# EAGLE design CurrentMetterLEDScreen (EAGLE 6.1)
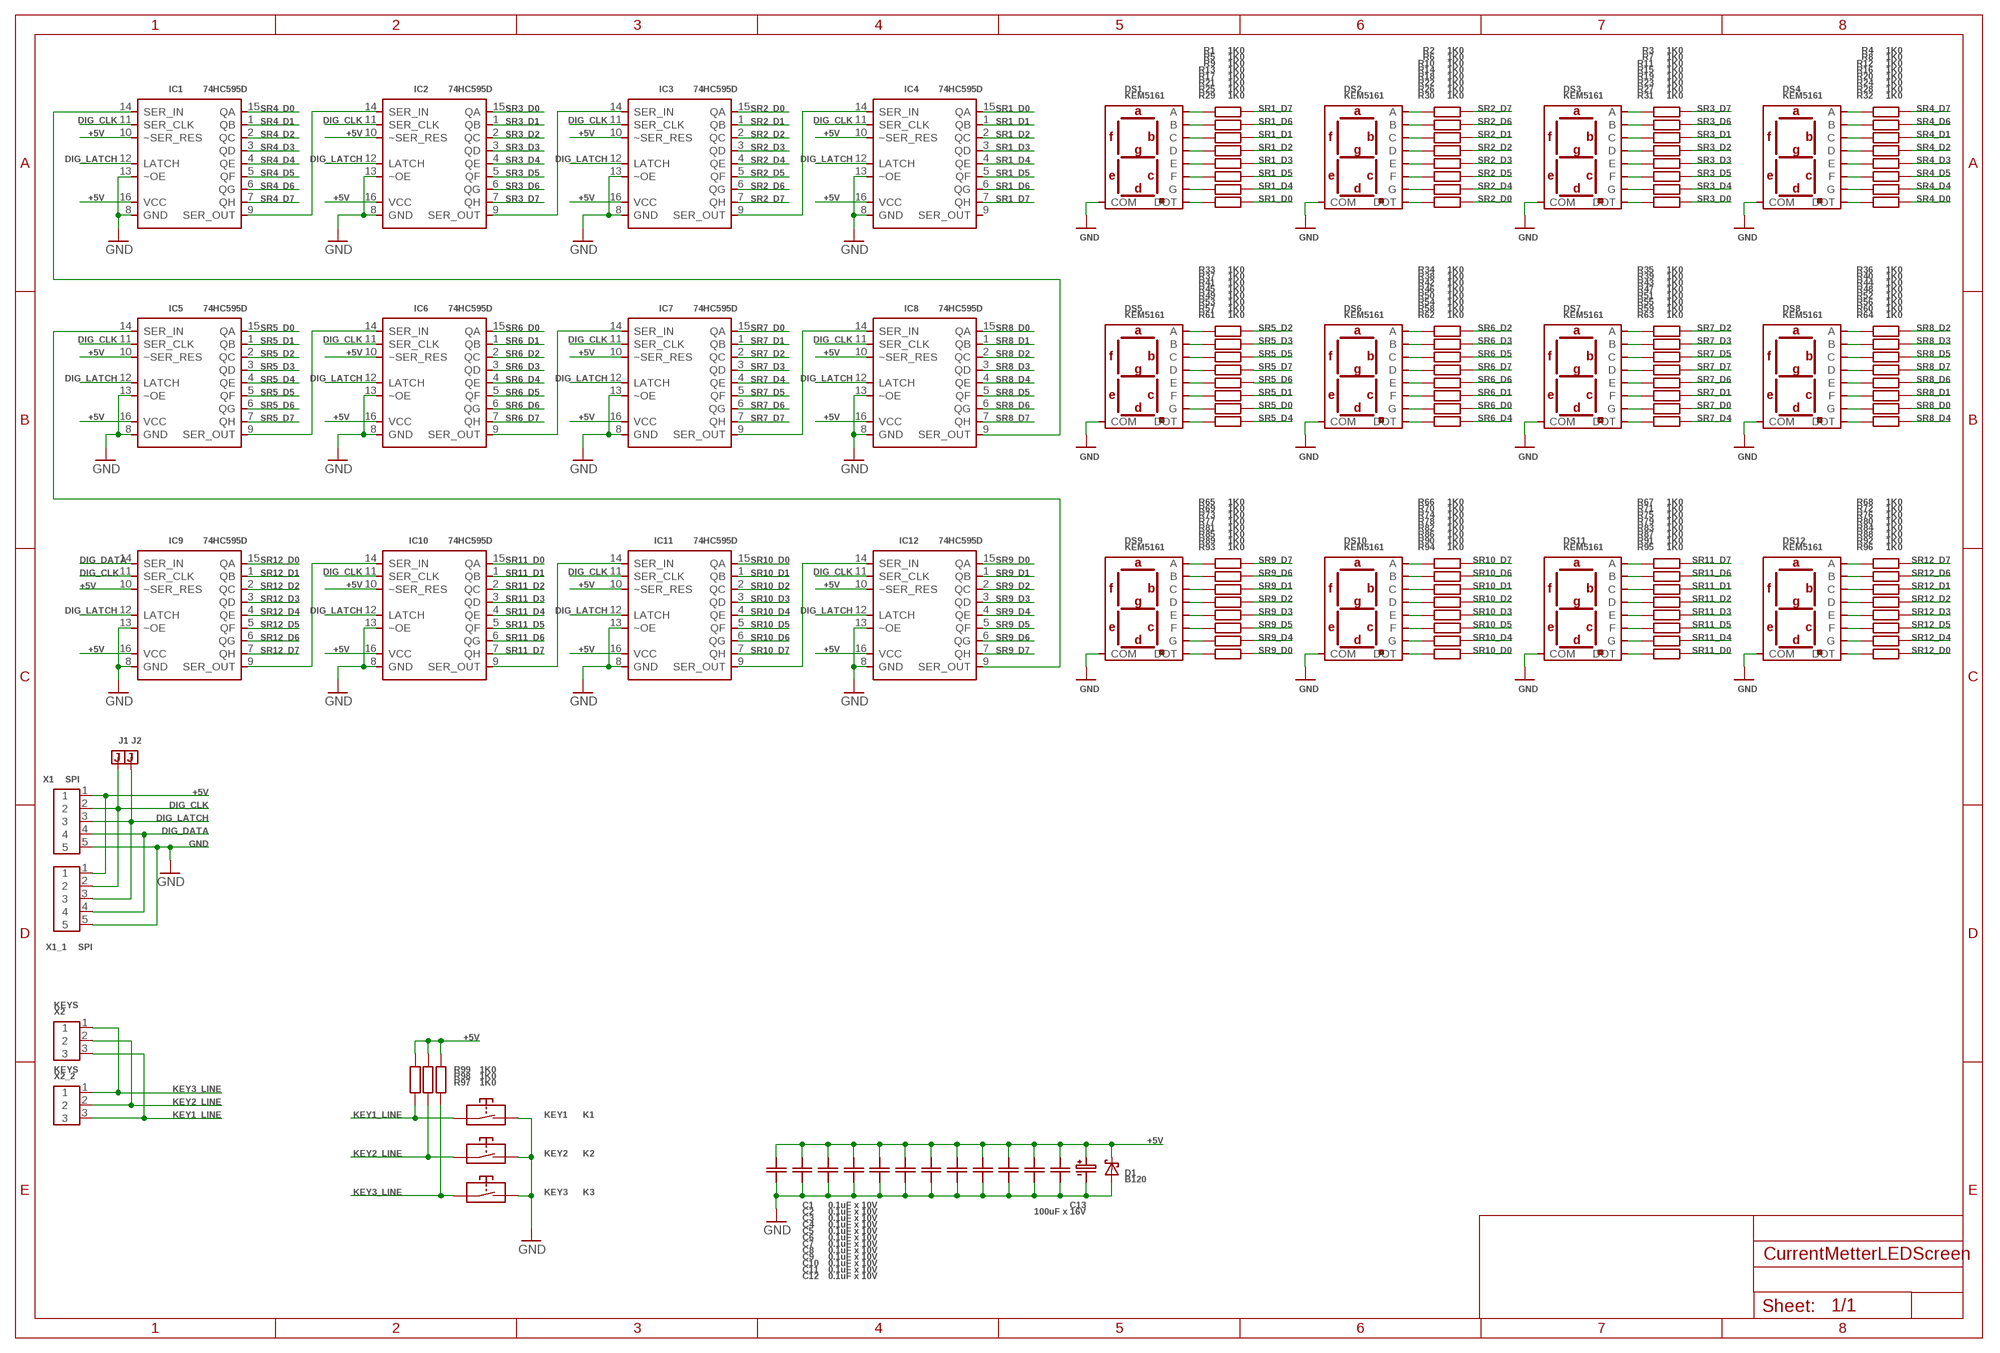
[diagram p0: schematic, sheet 1]

## Parts
C1  0.1uF x 10V  CSMD_0603  [RSMD_0603]
C2  0.1uF x 10V  CSMD_0603  [RSMD_0603]
C3  0.1uF x 10V  CSMD_0603  [RSMD_0603]
C4  0.1uF x 10V  CSMD_0603  [RSMD_0603]
C5  0.1uF x 10V  CSMD_0603  [RSMD_0603]
C6  0.1uF x 10V  CSMD_0603  [RSMD_0603]
C7  0.1uF x 10V  CSMD_0603  [RSMD_0603]
C8  0.1uF x 10V  CSMD_0603  [RSMD_0603]
C9  0.1uF x 10V  CSMD_0603  [RSMD_0603]
C10  0.1uF x 10V  CSMD_0603  [RSMD_0603]
C11  0.1uF x 10V  CSMD_0603  [RSMD_0603]
C12  0.1uF x 10V  CSMD_0603  [RSMD_0603]
C13  100uF x 16V  CE6.3MM_HOR_REVERTED  [CE_6.3MM_HOR_REVERTED]
D1  B120  B120(DO-214AC)  [DO-214AC]
DS1  KEM5161  KEM5161(NARROW_PADS_OUTSIDE)  [KEM-5161(NARROW_PADS_OUTSIDE)]
DS2  KEM5161  KEM5161(NARROW_PADS_OUTSIDE)  [KEM-5161(NARROW_PADS_OUTSIDE)]
DS3  KEM5161  KEM5161(NARROW_PADS_OUTSIDE)  [KEM-5161(NARROW_PADS_OUTSIDE)]
DS4  KEM5161  KEM5161(NARROW_PADS_OUTSIDE)  [KEM-5161(NARROW_PADS_OUTSIDE)]
DS5  KEM5161  KEM5161(NARROW_PADS_OUTSIDE)  [KEM-5161(NARROW_PADS_OUTSIDE)]
DS6  KEM5161  KEM5161(NARROW_PADS_OUTSIDE)  [KEM-5161(NARROW_PADS_OUTSIDE)]
DS7  KEM5161  KEM5161(NARROW_PADS_OUTSIDE)  [KEM-5161(NARROW_PADS_OUTSIDE)]
DS8  KEM5161  KEM5161(NARROW_PADS_OUTSIDE)  [KEM-5161(NARROW_PADS_OUTSIDE)]
DS9  KEM5161  KEM5161(NARROW_PADS_OUTSIDE)  [KEM-5161(NARROW_PADS_OUTSIDE)]
DS10  KEM5161  KEM5161(NARROW_PADS_OUTSIDE)  [KEM-5161(NARROW_PADS_OUTSIDE)]
DS11  KEM5161  KEM5161(NARROW_PADS_OUTSIDE)  [KEM-5161(NARROW_PADS_OUTSIDE)]
DS12  KEM5161  KEM5161(NARROW_PADS_OUTSIDE)  [KEM-5161(NARROW_PADS_OUTSIDE)]
IC1  74HC595D  74HC595(SOIC16)  [SOIC16]
IC2  74HC595D  74HC595(SOIC16)  [SOIC16]
IC3  74HC595D  74HC595(SOIC16)  [SOIC16]
IC4  74HC595D  74HC595(SOIC16)  [SOIC16]
IC5  74HC595D  74HC595(SOIC16)  [SOIC16]
IC6  74HC595D  74HC595(SOIC16)  [SOIC16]
IC7  74HC595D  74HC595(SOIC16)  [SOIC16]
IC8  74HC595D  74HC595(SOIC16)  [SOIC16]
IC9  74HC595D  74HC595(SOIC16)  [SOIC16]
IC10  74HC595D  74HC595(SOIC16)  [SOIC16]
IC11  74HC595D  74HC595(SOIC16)  [SOIC16]
IC12  74HC595D  74HC595(SOIC16)  [SOIC16]
J1  JUMPER0805  [RSMD_0805]
J2  JUMPER0805  [RSMD_0805]
KEY1  K1  KEY(7X4.5_BIG_PADS)  [KEY_7X4.5_BIG_PADS]
KEY2  K2  KEY(7X4.5_BIG_PADS)  [KEY_7X4.5_BIG_PADS]
KEY3  K3  KEY(7X4.5_BIG_PADS)  [KEY_7X4.5_BIG_PADS]
R1  1K0  RSMD_0603  [RSMD_0603]
R2  1K0  RSMD_0603  [RSMD_0603]
R3  1K0  RSMD_0603  [RSMD_0603]
R4  1K0  RSMD_0603  [RSMD_0603]
R5  1K0  RSMD_0603  [RSMD_0603]
R6  1K0  RSMD_0603  [RSMD_0603]
R7  1K0  RSMD_0603  [RSMD_0603]
R8  1K0  RSMD_0603  [RSMD_0603]
R9  1K0  RSMD_0603  [RSMD_0603]
R10  1K0  RSMD_0603  [RSMD_0603]
R11  1K0  RSMD_0603  [RSMD_0603]
R12  1K0  RSMD_0603  [RSMD_0603]
R13  1K0  RSMD_0603  [RSMD_0603]
R14  1K0  RSMD_0603  [RSMD_0603]
R15  1K0  RSMD_0603  [RSMD_0603]
R16  1K0  RSMD_0603  [RSMD_0603]
R17  1K0  RSMD_0603  [RSMD_0603]
R18  1K0  RSMD_0603  [RSMD_0603]
R19  1K0  RSMD_0603  [RSMD_0603]
R20  1K0  RSMD_0603  [RSMD_0603]
R21  1K0  RSMD_0603  [RSMD_0603]
R22  1K0  RSMD_0603  [RSMD_0603]
R23  1K0  RSMD_0603  [RSMD_0603]
R24  1K0  RSMD_0603  [RSMD_0603]
R25  1K0  RSMD_0603  [RSMD_0603]
R26  1K0  RSMD_0603  [RSMD_0603]
R27  1K0  RSMD_0603  [RSMD_0603]
R28  1K0  RSMD_0603  [RSMD_0603]
R29  1K0  RSMD_0603  [RSMD_0603]
R30  1K0  RSMD_0603  [RSMD_0603]
R31  1K0  RSMD_0603  [RSMD_0603]
R32  1K0  RSMD_0603  [RSMD_0603]
R33  1K0  RSMD_0603  [RSMD_0603]
R34  1K0  RSMD_0603  [RSMD_0603]
R35  1K0  RSMD_0603  [RSMD_0603]
R36  1K0  RSMD_0603  [RSMD_0603]
R37  1K0  RSMD_0603  [RSMD_0603]
R38  1K0  RSMD_0603  [RSMD_0603]
R39  1K0  RSMD_0603  [RSMD_0603]
R40  1K0  RSMD_0603  [RSMD_0603]
R41  1K0  RSMD_0603  [RSMD_0603]
R42  1K0  RSMD_0603  [RSMD_0603]
R43  1K0  RSMD_0603  [RSMD_0603]
R44  1K0  RSMD_0603  [RSMD_0603]
R45  1K0  RSMD_0603  [RSMD_0603]
R46  1K0  RSMD_0603  [RSMD_0603]
R47  1K0  RSMD_0603  [RSMD_0603]
R48  1K0  RSMD_0603  [RSMD_0603]
R49  1K0  RSMD_0603  [RSMD_0603]
R50  1K0  RSMD_0603  [RSMD_0603]
R51  1K0  RSMD_0603  [RSMD_0603]
R52  1K0  RSMD_0603  [RSMD_0603]
R53  1K0  RSMD_0603  [RSMD_0603]
R54  1K0  RSMD_0603  [RSMD_0603]
R55  1K0  RSMD_0603  [RSMD_0603]
R56  1K0  RSMD_0603  [RSMD_0603]
R57  1K0  RSMD_0603  [RSMD_0603]
R58  1K0  RSMD_0603  [RSMD_0603]
R59  1K0  RSMD_0603  [RSMD_0603]
R60  1K0  RSMD_0603  [RSMD_0603]
R61  1K0  RSMD_0603  [RSMD_0603]
R62  1K0  RSMD_0603  [RSMD_0603]
R63  1K0  RSMD_0603  [RSMD_0603]
R64  1K0  RSMD_0603  [RSMD_0603]
R65  1K0  RSMD_0603  [RSMD_0603]
R66  1K0  RSMD_0603  [RSMD_0603]
R67  1K0  RSMD_0603  [RSMD_0603]
R68  1K0  RSMD_0603  [RSMD_0603]
R69  1K0  RSMD_0603  [RSMD_0603]
R70  1K0  RSMD_0603  [RSMD_0603]
R71  1K0  RSMD_0603  [RSMD_0603]
R72  1K0  RSMD_0603  [RSMD_0603]
R73  1K0  RSMD_0603  [RSMD_0603]
R74  1K0  RSMD_0603  [RSMD_0603]
R75  1K0  RSMD_0603  [RSMD_0603]
R76  1K0  RSMD_0603  [RSMD_0603]
R77  1K0  RSMD_0603  [RSMD_0603]
R78  1K0  RSMD_0603  [RSMD_0603]
R79  1K0  RSMD_0603  [RSMD_0603]
R80  1K0  RSMD_0603  [RSMD_0603]
R81  1K0  RSMD_0603  [RSMD_0603]
R82  1K0  RSMD_0603  [RSMD_0603]
R83  1K0  RSMD_0603  [RSMD_0603]
R84  1K0  RSMD_0603  [RSMD_0603]
R85  1K0  RSMD_0603  [RSMD_0603]
R86  1K0  RSMD_0603  [RSMD_0603]
R87  1K0  RSMD_0603  [RSMD_0603]
R88  1K0  RSMD_0603  [RSMD_0603]
R89  1K0  RSMD_0603  [RSMD_0603]
R90  1K0  RSMD_0603  [RSMD_0603]
R91  1K0  RSMD_0603  [RSMD_0603]
R92  1K0  RSMD_0603  [RSMD_0603]
R93  1K0  RSMD_0603  [RSMD_0603]
R94  1K0  RSMD_0603  [RSMD_0603]
R95  1K0  RSMD_0603  [RSMD_0603]
R96  1K0  RSMD_0603  [RSMD_0603]
R97  1K0  RSMD_0603  [RSMD_0603]
R98  1K0  RSMD_0603  [RSMD_0603]
R99  1K0  RSMD_0603  [RSMD_0603]
X1  SPI  PIN1X5(2.54_SIDE_BOARD)  [PIN5X1_2.54MM_SIDE_BOARD]
X1_1  SPI  PIN1X5(2.54_VERT_CLAMP)  [PIN5X1_2.54MM_WITH_CLAMP]
X2  KEYS  PIN1X3(2.54MM_SIDE_BOARD)  [PIN1X3_2.54MM_SIDE_BOARD]
X2_2  KEYS  PIN1X3(2.54MM_WITH_CLAMP)  [PIN3X1_2.54MM_WITH_CLAMP]

## Nets
+5V: C1.PAD_1(PIN1) C2.PAD_1(PIN1) C3.PAD_1(PIN1) C4.PAD_1(PIN1) C5.PAD_1(PIN1) C6.PAD_1(PIN1) C7.PAD_1(PIN1) C8.PAD_1(PIN1) C9.PAD_1(PIN1) C10.PAD_1(PIN1) C11.PAD_1(PIN1) C12.PAD_1(PIN1) C13.PLUS D1.CATHODE IC1.10(~SER_RES) IC1.16(VCC) IC2.10(~SER_RES) IC2.16(VCC) IC3.10(~SER_RES) IC3.16(VCC) IC4.10(~SER_RES) IC4.16(VCC) IC5.10(~SER_RES) IC5.16(VCC) IC6.10(~SER_RES) IC6.16(VCC) IC7.10(~SER_RES) IC7.16(VCC) IC8.10(~SER_RES) IC8.16(VCC) IC9.10(~SER_RES) IC9.16(VCC) IC10.10(~SER_RES) IC10.16(VCC) IC11.10(~SER_RES) IC11.16(VCC) IC12.10(~SER_RES) IC12.16(VCC) R97.PAD_1(PIN1) R98.PAD_1(PIN1) R99.PAD_1(PIN1) X1.1 X1_1.1
DIG_CLK: IC1.11(SER_CLK) IC2.11(SER_CLK) IC3.11(SER_CLK) IC4.11(SER_CLK) IC5.11(SER_CLK) IC6.11(SER_CLK) IC7.11(SER_CLK) IC8.11(SER_CLK) IC9.11(SER_CLK) IC10.11(SER_CLK) IC11.11(SER_CLK) IC12.11(SER_CLK) J1.PAD_0(PIN1) J1.PAD_1(PIN1) X1.2 X1_1.2
DIG_DATA: IC9.14(SER_IN) X1.4 X1_1.4
DIG_LATCH: IC1.12(LATCH) IC2.12(LATCH) IC3.12(LATCH) IC4.12(LATCH) IC5.12(LATCH) IC6.12(LATCH) IC7.12(LATCH) IC8.12(LATCH) IC9.12(LATCH) IC10.12(LATCH) IC11.12(LATCH) IC12.12(LATCH) J2.PAD_0(PIN1) J2.PAD_1(PIN1) X1.3 X1_1.3
GND: C1.PAD_0(PIN0) C2.PAD_0(PIN0) C3.PAD_0(PIN0) C4.PAD_0(PIN0) C5.PAD_0(PIN0) C6.PAD_0(PIN0) C7.PAD_0(PIN0) C8.PAD_0(PIN0) C9.PAD_0(PIN0) C10.PAD_0(PIN0) C11.PAD_0(PIN0) C12.PAD_0(PIN0) C13.MINUS D1.ANODE DS1.3(COM) DS1.8(COM) DS2.3(COM) DS2.8(COM) DS3.3(COM) DS3.8(COM) DS4.3(COM) DS4.8(COM) DS5.3(COM) DS5.8(COM) DS6.3(COM) DS6.8(COM) DS7.3(COM) DS7.8(COM) DS8.3(COM) DS8.8(COM) DS9.3(COM) DS9.8(COM) DS10.3(COM) DS10.8(COM) DS11.3(COM) DS11.8(COM) DS12.3(COM) DS12.8(COM) IC1.8(GND) IC1.13(~OE) IC2.8(GND) IC2.13(~OE) IC3.8(GND) IC3.13(~OE) IC4.8(GND) IC4.13(~OE) IC5.8(GND) IC5.13(~OE) IC6.8(GND) IC6.13(~OE) IC7.8(GND) IC7.13(~OE) IC8.8(GND) IC8.13(~OE) IC9.8(GND) IC9.13(~OE) IC10.8(GND) IC10.13(~OE) IC11.8(GND) IC11.13(~OE) IC12.8(GND) IC12.13(~OE) KEY1.3 KEY1.4 KEY2.3 KEY2.4 KEY3.3 KEY3.4 X1.5 X1_1.5
KEY1_LINE: KEY1.1 KEY1.2 R99.PAD_0(PIN0) X2.3 X2_2.3
KEY2_LINE: KEY2.1 KEY2.2 R98.PAD_0(PIN0) X2.2 X2_2.2
KEY3_LINE: KEY3.1 KEY3.2 R97.PAD_0(PIN0) X2.1 X2_2.1
N$1: DS4.7(A) R4.PAD_0(PIN0)
N$2: DS4.6(B) R8.PAD_0(PIN0)
N$3: DS4.4(C) R12.PAD_0(PIN0)
N$4: DS4.2(D) R16.PAD_0(PIN0)
N$5: DS4.1(E) R20.PAD_0(PIN0)
N$6: DS4.9(F) R24.PAD_0(PIN0)
N$7: DS4.10(G) R28.PAD_0(PIN0)
N$8: DS4.5(DOT) R32.PAD_0(PIN0)
N$9: DS8.7(A) R36.PAD_0(PIN0)
N$10: DS8.6(B) R40.PAD_0(PIN0)
N$11: DS8.4(C) R44.PAD_0(PIN0)
N$12: DS8.2(D) R48.PAD_0(PIN0)
N$13: DS8.1(E) R52.PAD_0(PIN0)
N$14: DS8.9(F) R56.PAD_0(PIN0)
N$15: DS8.10(G) R60.PAD_0(PIN0)
N$16: DS8.5(DOT) R64.PAD_0(PIN0)
N$17: DS3.7(A) R3.PAD_0(PIN0)
N$18: DS3.6(B) R7.PAD_0(PIN0)
N$19: DS3.4(C) R11.PAD_0(PIN0)
N$20: DS3.2(D) R15.PAD_0(PIN0)
N$21: IC3.9(SER_OUT) IC4.14(SER_IN)
N$22: DS3.1(E) R19.PAD_0(PIN0)
N$23: DS3.9(F) R23.PAD_0(PIN0)
N$24: DS3.10(G) R27.PAD_0(PIN0)
N$25: DS3.5(DOT) R31.PAD_0(PIN0)
N$26: IC2.9(SER_OUT) IC3.14(SER_IN)
N$27: IC1.9(SER_OUT) IC2.14(SER_IN)
N$28: DS7.7(A) R35.PAD_0(PIN0)
N$29: DS7.6(B) R39.PAD_0(PIN0)
N$30: DS7.4(C) R43.PAD_0(PIN0)
N$31: DS7.2(D) R47.PAD_0(PIN0)
N$32: DS7.1(E) R51.PAD_0(PIN0)
N$33: DS7.9(F) R55.PAD_0(PIN0)
N$34: DS7.10(G) R59.PAD_0(PIN0)
N$35: DS7.5(DOT) R63.PAD_0(PIN0)
N$36: DS2.7(A) R2.PAD_0(PIN0)
N$37: DS2.6(B) R6.PAD_0(PIN0)
N$38: DS2.4(C) R10.PAD_0(PIN0)
N$39: DS2.2(D) R14.PAD_0(PIN0)
N$40: DS2.1(E) R18.PAD_0(PIN0)
N$41: DS2.9(F) R22.PAD_0(PIN0)
N$42: DS2.10(G) R26.PAD_0(PIN0)
N$43: DS2.5(DOT) R30.PAD_0(PIN0)
N$44: DS6.7(A) R34.PAD_0(PIN0)
N$45: DS6.6(B) R38.PAD_0(PIN0)
N$46: DS6.4(C) R42.PAD_0(PIN0)
N$47: DS6.2(D) R46.PAD_0(PIN0)
N$48: DS6.1(E) R50.PAD_0(PIN0)
N$49: DS6.9(F) R54.PAD_0(PIN0)
N$50: DS6.10(G) R58.PAD_0(PIN0)
N$51: DS6.5(DOT) R62.PAD_0(PIN0)
N$52: DS5.7(A) R33.PAD_0(PIN0)
N$53: DS1.7(A) R1.PAD_0(PIN0)
N$54: DS1.6(B) R5.PAD_0(PIN0)
N$55: DS1.4(C) R9.PAD_0(PIN0)
N$56: DS1.2(D) R13.PAD_0(PIN0)
N$57: DS1.1(E) R17.PAD_0(PIN0)
N$58: DS1.9(F) R21.PAD_0(PIN0)
N$59: DS1.10(G) R25.PAD_0(PIN0)
N$60: DS1.5(DOT) R29.PAD_0(PIN0)
N$61: DS5.6(B) R37.PAD_0(PIN0)
N$62: DS5.4(C) R41.PAD_0(PIN0)
N$63: DS5.2(D) R45.PAD_0(PIN0)
N$64: DS5.1(E) R49.PAD_0(PIN0)
N$65: DS5.9(F) R53.PAD_0(PIN0)
N$66: DS5.10(G) R57.PAD_0(PIN0)
N$67: DS5.5(DOT) R61.PAD_0(PIN0)
N$68: IC7.9(SER_OUT) IC8.14(SER_IN)
N$69: IC6.9(SER_OUT) IC7.14(SER_IN)
N$70: IC5.9(SER_OUT) IC6.14(SER_IN)
N$71: DS12.7(A) R68.PAD_0(PIN0)
N$72: DS12.6(B) R72.PAD_0(PIN0)
N$73: DS12.4(C) R76.PAD_0(PIN0)
N$74: DS12.2(D) R80.PAD_0(PIN0)
N$75: DS12.1(E) R84.PAD_0(PIN0)
N$76: DS12.9(F) R88.PAD_0(PIN0)
N$77: DS12.10(G) R92.PAD_0(PIN0)
N$78: DS12.5(DOT) R96.PAD_0(PIN0)
N$79: DS11.7(A) R67.PAD_0(PIN0)
N$80: DS11.6(B) R71.PAD_0(PIN0)
N$81: DS11.4(C) R75.PAD_0(PIN0)
N$82: DS11.2(D) R79.PAD_0(PIN0)
N$83: DS11.1(E) R83.PAD_0(PIN0)
N$84: DS11.9(F) R87.PAD_0(PIN0)
N$85: DS11.10(G) R91.PAD_0(PIN0)
N$86: DS11.5(DOT) R95.PAD_0(PIN0)
N$87: DS10.7(A) R66.PAD_0(PIN0)
N$88: DS10.6(B) R70.PAD_0(PIN0)
N$89: DS10.4(C) R74.PAD_0(PIN0)
N$90: DS10.2(D) R78.PAD_0(PIN0)
N$91: DS10.1(E) R82.PAD_0(PIN0)
N$92: DS10.9(F) R86.PAD_0(PIN0)
N$93: DS10.10(G) R90.PAD_0(PIN0)
N$94: DS10.5(DOT) R94.PAD_0(PIN0)
N$95: DS9.7(A) R65.PAD_0(PIN0)
N$96: DS9.6(B) R69.PAD_0(PIN0)
N$97: DS9.4(C) R73.PAD_0(PIN0)
N$98: DS9.2(D) R77.PAD_0(PIN0)
N$99: DS9.1(E) R81.PAD_0(PIN0)
N$100: DS9.9(F) R85.PAD_0(PIN0)
N$101: DS9.10(G) R89.PAD_0(PIN0)
N$102: DS9.5(DOT) R93.PAD_0(PIN0)
N$103: IC11.9(SER_OUT) IC12.14(SER_IN)
N$104: IC10.9(SER_OUT) IC11.14(SER_IN)
N$105: IC9.9(SER_OUT) IC10.14(SER_IN)
N$106: IC1.14(SER_IN) IC8.9(SER_OUT)
N$107: IC5.14(SER_IN) IC12.9(SER_OUT)
SR1_D0: IC4.15(QA) R29.PAD_1(PIN1)
SR1_D1: IC4.1(QB) R9.PAD_1(PIN1)
SR1_D2: IC4.2(QC) R13.PAD_1(PIN1)
SR1_D3: IC4.3(QD) R17.PAD_1(PIN1)
SR1_D4: IC4.4(QE) R25.PAD_1(PIN1)
SR1_D5: IC4.5(QF) R21.PAD_1(PIN1)
SR1_D6: IC4.6(QG) R5.PAD_1(PIN1)
SR1_D7: IC4.7(QH) R1.PAD_1(PIN1)
SR2_D0: IC3.15(QA) R30.PAD_1(PIN1)
SR2_D1: IC3.1(QB) R10.PAD_1(PIN1)
SR2_D2: IC3.2(QC) R14.PAD_1(PIN1)
SR2_D3: IC3.3(QD) R18.PAD_1(PIN1)
SR2_D4: IC3.4(QE) R26.PAD_1(PIN1)
SR2_D5: IC3.5(QF) R22.PAD_1(PIN1)
SR2_D6: IC3.6(QG) R6.PAD_1(PIN1)
SR2_D7: IC3.7(QH) R2.PAD_1(PIN1)
SR3_D0: IC2.15(QA) R31.PAD_1(PIN1)
SR3_D1: IC2.1(QB) R11.PAD_1(PIN1)
SR3_D2: IC2.2(QC) R15.PAD_1(PIN1)
SR3_D3: IC2.3(QD) R19.PAD_1(PIN1)
SR3_D4: IC2.4(QE) R27.PAD_1(PIN1)
SR3_D5: IC2.5(QF) R23.PAD_1(PIN1)
SR3_D6: IC2.6(QG) R7.PAD_1(PIN1)
SR3_D7: IC2.7(QH) R3.PAD_1(PIN1)
SR4_D0: IC1.15(QA) R32.PAD_1(PIN1)
SR4_D1: IC1.1(QB) R12.PAD_1(PIN1)
SR4_D2: IC1.2(QC) R16.PAD_1(PIN1)
SR4_D3: IC1.3(QD) R20.PAD_1(PIN1)
SR4_D4: IC1.4(QE) R28.PAD_1(PIN1)
SR4_D5: IC1.5(QF) R24.PAD_1(PIN1)
SR4_D6: IC1.6(QG) R8.PAD_1(PIN1)
SR4_D7: IC1.7(QH) R4.PAD_1(PIN1)
SR5_D0: IC5.15(QA) R57.PAD_1(PIN1)
SR5_D1: IC5.1(QB) R53.PAD_1(PIN1)
SR5_D2: IC5.2(QC) R33.PAD_1(PIN1)
SR5_D3: IC5.3(QD) R37.PAD_1(PIN1)
SR5_D4: IC5.4(QE) R61.PAD_1(PIN1)
SR5_D5: IC5.5(QF) R41.PAD_1(PIN1)
SR5_D6: IC5.6(QG) R49.PAD_1(PIN1)
SR5_D7: IC5.7(QH) R45.PAD_1(PIN1)
SR6_D0: IC6.15(QA) R58.PAD_1(PIN1)
SR6_D1: IC6.1(QB) R54.PAD_1(PIN1)
SR6_D2: IC6.2(QC) R34.PAD_1(PIN1)
SR6_D3: IC6.3(QD) R38.PAD_1(PIN1)
SR6_D4: IC6.4(QE) R62.PAD_1(PIN1)
SR6_D5: IC6.5(QF) R42.PAD_1(PIN1)
SR6_D6: IC6.6(QG) R50.PAD_1(PIN1)
SR6_D7: IC6.7(QH) R46.PAD_1(PIN1)
SR7_D0: IC7.15(QA) R59.PAD_1(PIN1)
SR7_D1: IC7.1(QB) R55.PAD_1(PIN1)
SR7_D2: IC7.2(QC) R35.PAD_1(PIN1)
SR7_D3: IC7.3(QD) R39.PAD_1(PIN1)
SR7_D4: IC7.4(QE) R63.PAD_1(PIN1)
SR7_D5: IC7.5(QF) R43.PAD_1(PIN1)
SR7_D6: IC7.6(QG) R51.PAD_1(PIN1)
SR7_D7: IC7.7(QH) R47.PAD_1(PIN1)
SR8_D0: IC8.15(QA) R60.PAD_1(PIN1)
SR8_D1: IC8.1(QB) R56.PAD_1(PIN1)
SR8_D2: IC8.2(QC) R36.PAD_1(PIN1)
SR8_D3: IC8.3(QD) R40.PAD_1(PIN1)
SR8_D4: IC8.4(QE) R64.PAD_1(PIN1)
SR8_D5: IC8.5(QF) R44.PAD_1(PIN1)
SR8_D6: IC8.6(QG) R52.PAD_1(PIN1)
SR8_D7: IC8.7(QH) R48.PAD_1(PIN1)
SR9_D0: IC12.15(QA) R93.PAD_1(PIN1)
SR9_D1: IC12.1(QB) R73.PAD_1(PIN1)
SR9_D2: IC12.2(QC) R77.PAD_1(PIN1)
SR9_D3: IC12.3(QD) R81.PAD_1(PIN1)
SR9_D4: IC12.4(QE) R89.PAD_1(PIN1)
SR9_D5: IC12.5(QF) R85.PAD_1(PIN1)
SR9_D6: IC12.6(QG) R69.PAD_1(PIN1)
SR9_D7: IC12.7(QH) R65.PAD_1(PIN1)
SR10_D0: IC11.15(QA) R94.PAD_1(PIN1)
SR10_D1: IC11.1(QB) R74.PAD_1(PIN1)
SR10_D2: IC11.2(QC) R78.PAD_1(PIN1)
SR10_D3: IC11.3(QD) R82.PAD_1(PIN1)
SR10_D4: IC11.4(QE) R90.PAD_1(PIN1)
SR10_D5: IC11.5(QF) R86.PAD_1(PIN1)
SR10_D6: IC11.6(QG) R70.PAD_1(PIN1)
SR10_D7: IC11.7(QH) R66.PAD_1(PIN1)
SR11_D0: IC10.15(QA) R95.PAD_1(PIN1)
SR11_D1: IC10.1(QB) R75.PAD_1(PIN1)
SR11_D2: IC10.2(QC) R79.PAD_1(PIN1)
SR11_D3: IC10.3(QD) R83.PAD_1(PIN1)
SR11_D4: IC10.4(QE) R91.PAD_1(PIN1)
SR11_D5: IC10.5(QF) R87.PAD_1(PIN1)
SR11_D6: IC10.6(QG) R71.PAD_1(PIN1)
SR11_D7: IC10.7(QH) R67.PAD_1(PIN1)
SR12_D0: IC9.15(QA) R96.PAD_1(PIN1)
SR12_D1: IC9.1(QB) R76.PAD_1(PIN1)
SR12_D2: IC9.2(QC) R80.PAD_1(PIN1)
SR12_D3: IC9.3(QD) R84.PAD_1(PIN1)
SR12_D4: IC9.4(QE) R92.PAD_1(PIN1)
SR12_D5: IC9.5(QF) R88.PAD_1(PIN1)
SR12_D6: IC9.6(QG) R72.PAD_1(PIN1)
SR12_D7: IC9.7(QH) R68.PAD_1(PIN1)
Unconnected: IC4.9(SER_OUT)

## Library data of the parts
C1-C12 = __MyCommonLib1:C
C13 = __MyCommonLib1:CE
D1 = __MyCommonLib1:B120
DS1-DS12 = __MyCommonLib1:KEM5161
IC1-IC12 = __MyCommonLib1:74HC595
J1 J2 = __MyCommonLib1:JUMPER
KEY1-KEY3 = __MyCommonLib1:KEY
R1-R99 = __MyCommonLib1:R
X1 X1_1 = __MyCommonLib1:PIN1X5
X2 X2_2 = __MyCommonLib1:PIN1X3

## Board
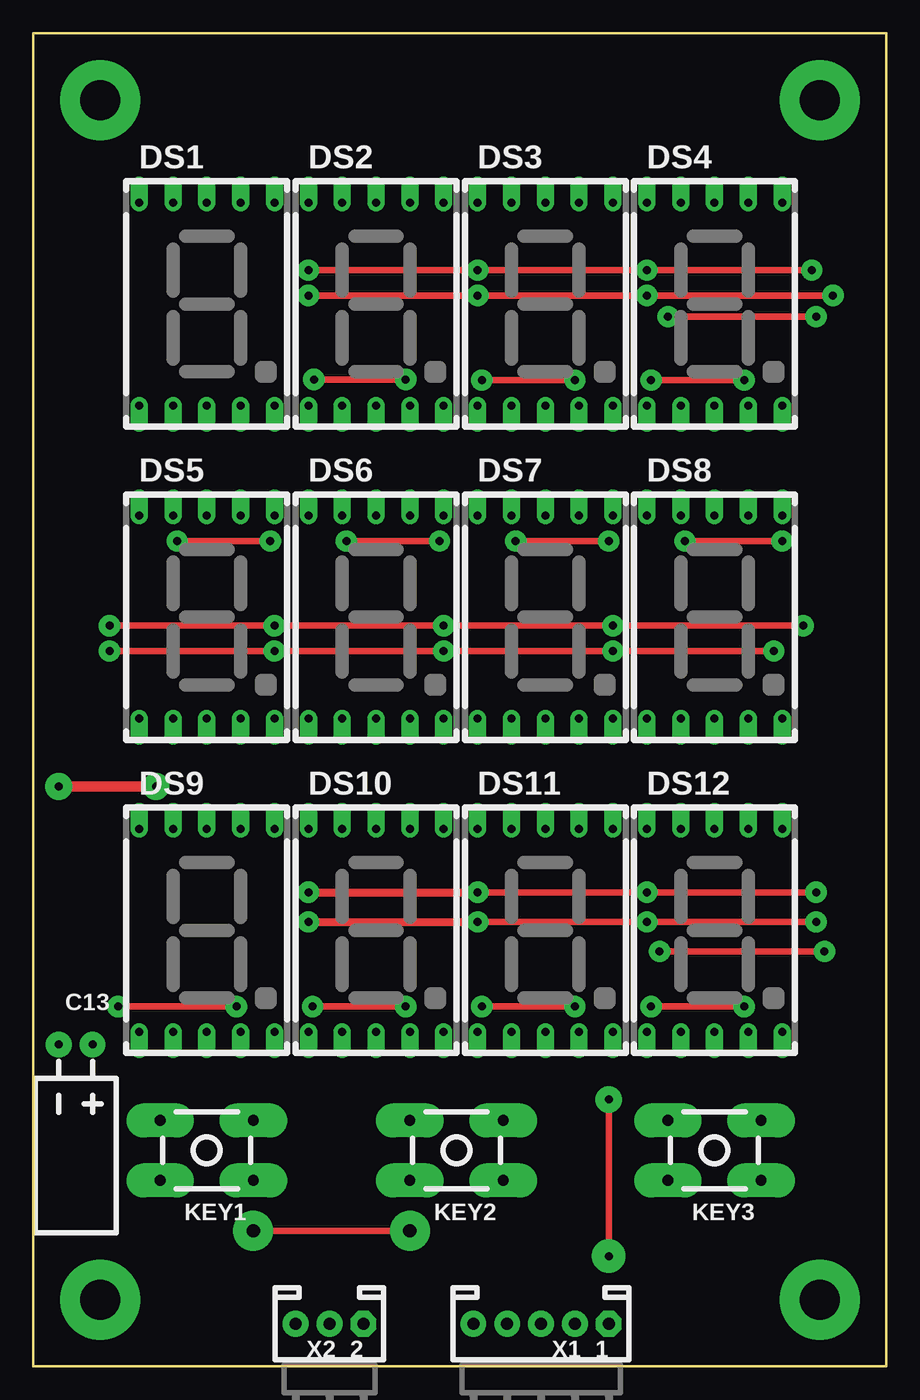
[diagram p1: board, top side]
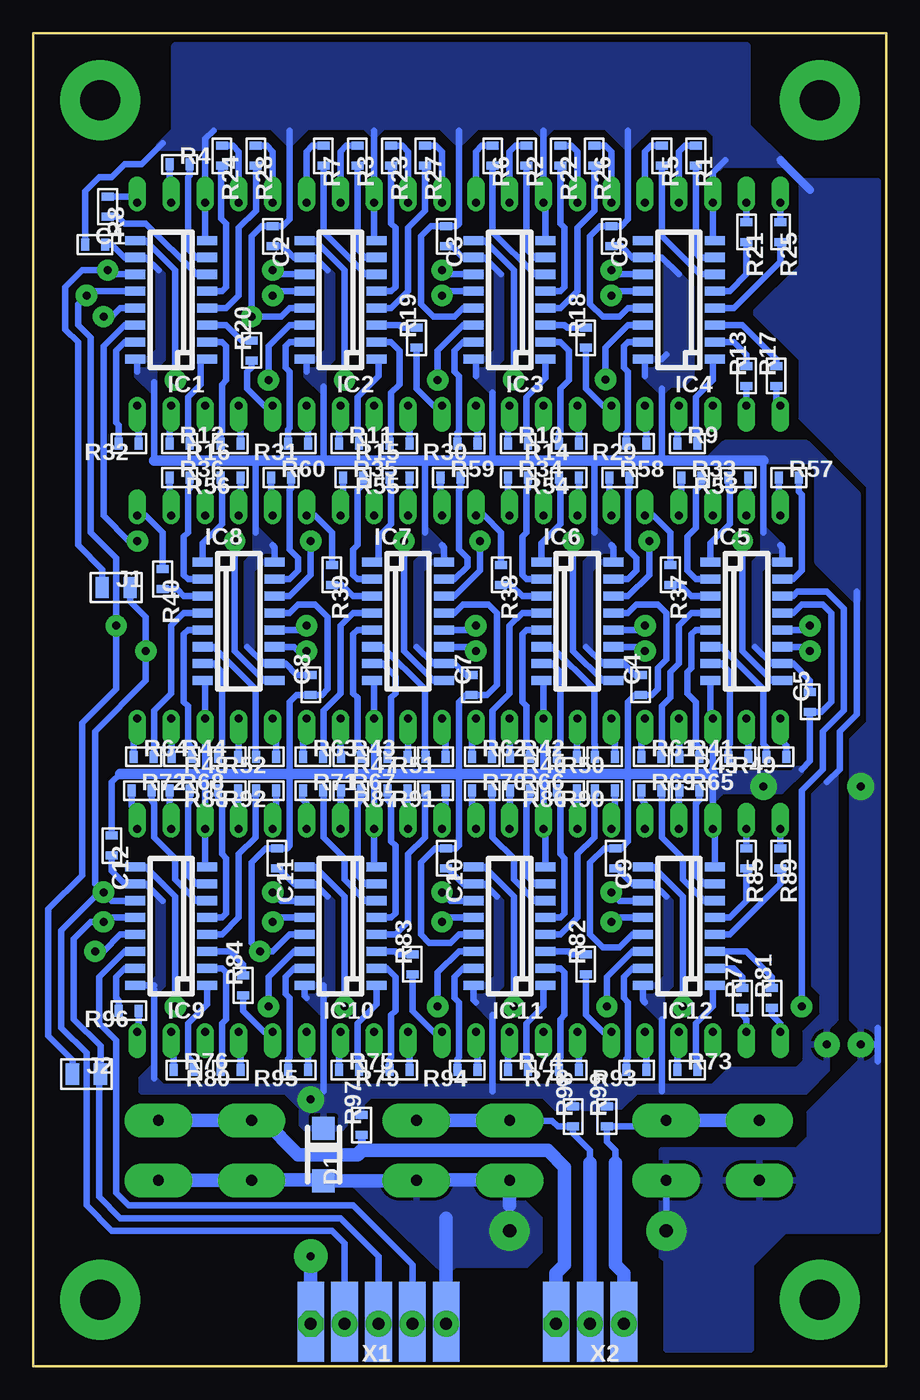
[diagram p2: board, bottom side, seen from below]

Size 64 x 100 mm. Coordinates in mm from the lower left corner, seen from the top.
Outline: 0,0 0,100 64,100 64,0 0,0
Copper layers (1*16): Top 0.035mm / dielectric 1.5mm / Bottom 0.035mm
Design rules: minimum track width 0.5mil, minimum drill 0.015240625mm, track to track 0.3mm, track to pad 0.3mm, pad to pad 0.3mm, via to via 0.3mm, smd to smd 0mil, copper to edge 0.1mm, drill to drill 2mil, minimum pad ring 10mil, minimum via ring 8mil, stop-mask expansion 4mil, vias tented up to drill 0mil, thermal gap 10mil

### Footprints (pad centres in the part's own frame; a part is rotated, then mirrored left to right if it is on the bottom)
RSMD_0603 = smd 0.6 x 0.9: PAD_0 -0.75,0; PAD_1 0.75,0
CE_6.3MM_HOR_REVERTED = drill 0.6 pad 1.93: MINUS 1.27,0; PLUS -1.27,0
DO-214AC = smd 1.72 x 1.68: ANODE 1.98,0; CATHODE -1.98,0
KEM-5161(NARROW_PADS_OUTSIDE) = drill 0.6 pad 1.3 offset: 1 -5.08,-7.62; 2 -2.54,-7.62; 3 0,-7.62; 4 2.54,-7.62; 5 5.08,-7.62; 6 5.08,7.62; 7 2.54,7.62; 8 0,7.62; 9 -2.54,7.62; 10 -5.08,7.62
SOIC16 = smd 1.5 x 0.68: 1 -2.699,4.445; 2 -2.699,3.175; 3 -2.699,1.905; 4 -2.699,0.635; 5 -2.699,-0.635; 6 -2.699,-1.905; 7 -2.699,-3.175; 8 -2.699,-4.445; 9 2.699,-4.445; 10 2.699,-3.175; 11 2.699,-1.905; 12 2.699,-0.635; 13 2.699,0.635; 14 2.699,1.905; 15 2.699,3.175; 16 2.699,4.445
RSMD_0805 = smd 1 x 1.6: PAD_0 -1.05,0; PAD_1 1.05,0
KEY_7X4.5_BIG_PADS = drill 0.8 pad 2.54 long: 1 -3.5,-2.25; 2 3.5,-2.25; 3 3.5,2.25; 4 -3.5,2.25
PIN5X1_2.54MM_SIDE_BOARD = smd 2 x 6: 1 -5.08,3; 2 -2.54,3; 3 0,3; 4 2.54,3; 5 5.08,3
PIN5X1_2.54MM_WITH_CLAMP = drill 0.9 pad 1.93 octagon: 1 -5.08,0 | drill 0.9 pad 1.93: 2 -2.54,0; 3 0,0; 4 2.54,0; 5 5.08,0
PIN1X3_2.54MM_SIDE_BOARD = smd 2 x 6: 1 -2.54,3; 2 0,3; 3 2.54,3
PIN3X1_2.54MM_WITH_CLAMP = drill 0.9 pad 1.93 octagon: 1 -2.54,0 | drill 0.9 pad 1.93: 2 0,0; 3 2.54,0

### Placement (x,y rotation side)
C1  59.37,84.14 0 bottom
C2  46.04,84.77 270 bottom
C3  33.02,84.77 270 bottom
C4  18.41,51.12 90 bottom
C5  5.71,49.85 90 bottom
C6  20.64,84.77 270 bottom
C7  31.11,51.12 90 bottom
C8  43.18,51.12 90 bottom
C9  20.32,38.1 270 bottom
C10  33.02,38.1 270 bottom
C11  45.72,38.1 270 bottom
C12  58.1,39.05 270 bottom
C13  3.17,24.13 180 top
D1  42.23,15.88 270 bottom
DS1  13.02,79.69 0 top
DS2  25.72,79.69 0 top
DS3  38.42,79.69 0 top
DS4  51.12,79.69 0 top
DS5  13.02,56.2 0 top
DS6  25.72,56.2 0 top
DS7  38.42,56.2 0 top
DS8  51.12,56.2 0 top
DS9  13.02,32.7 0 top
DS10  25.72,32.7 0 top
DS11  38.42,32.7 0 top
DS12  51.12,32.7 0 top
IC1  53.66,80.01 180 bottom
IC2  40.96,80.01 180 bottom
IC3  28.26,80.01 180 bottom
IC4  15.56,80.01 180 bottom
IC5  10.48,55.88 0 bottom
IC6  23.18,55.88 0 bottom
IC7  35.88,55.88 0 bottom
IC8  48.58,55.88 0 bottom
IC9  53.66,33.02 180 bottom
IC10  40.96,33.02 180 bottom
IC11  28.26,33.02 180 bottom
IC12  15.56,33.02 180 bottom
J1  57.78,58.42 0 bottom
J2  60.01,21.91 0 bottom
KEY1  13.02,16.19 180 top
KEY2  31.75,16.19 180 top
KEY3  51.12,16.19 180 top
R1  14.29,90.81 270 bottom
R2  26.99,90.81 270 bottom
R3  39.69,90.81 270 bottom
R4  53.02,90.17 0 bottom
R5  16.83,90.81 270 bottom
R6  29.53,90.81 270 bottom
R7  42.23,90.81 270 bottom
R8  58.42,87 270 bottom
R9  14.92,69.22 0 bottom
R10  27.62,69.22 0 bottom
R11  40.32,69.22 0 bottom
R12  53.02,69.22 0 bottom
R13  10.48,74.3 90 bottom
R14  23.81,69.22 180 bottom
R15  36.51,69.22 180 bottom
R16  49.21,69.22 180 bottom
R17  8.26,74.3 90 bottom
R18  22.54,77.15 90 bottom
R19  35.24,77.15 90 bottom
R20  47.62,76.2 90 bottom
R21  10.48,85.09 270 bottom
R22  24.45,90.81 270 bottom
R23  37.15,90.81 270 bottom
R24  49.85,90.81 270 bottom
R25  7.94,85.09 270 bottom
R26  21.91,90.81 270 bottom
R27  34.61,90.81 270 bottom
R28  47.31,90.81 270 bottom
R29  18.73,69.22 180 bottom
R30  31.43,69.22 180 bottom
R31  44.13,69.22 180 bottom
R32  56.83,69.22 180 bottom
R33  14.61,66.67 0 bottom
R34  27.62,66.67 0 bottom
R35  40.01,66.67 0 bottom
R36  53.02,66.67 0 bottom
R37  16.19,59.37 270 bottom
R38  28.89,59.37 270 bottom
R39  41.59,59.37 270 bottom
R40  54.29,59.05 270 bottom
R41  14.76,45.72 0 bottom
R42  27.46,45.72 0 bottom
R43  40.16,45.72 0 bottom
R44  52.86,45.72 0 bottom
R45  11.11,45.72 180 bottom
R46  23.97,45.72 180 bottom
R47  36.67,45.72 180 bottom
R48  49.37,45.72 180 bottom
R49  8.26,45.72 180 bottom
R50  21.11,45.72 180 bottom
R51  33.81,45.72 180 bottom
R52  46.51,45.72 180 bottom
R53  11.11,66.67 180 bottom
R54  23.81,66.67 180 bottom
R55  36.51,66.67 180 bottom
R56  49.21,66.67 180 bottom
R57  7.3,66.67 0 bottom
R58  20,66.67 0 bottom
R59  32.7,66.67 0 bottom
R60  45.4,66.67 0 bottom
R61  17.62,45.72 0 bottom
R62  30.32,45.72 0 bottom
R63  43.02,45.72 0 bottom
R64  55.72,45.72 0 bottom
R65  14.76,43.18 0 bottom
R66  27.46,43.18 0 bottom
R67  40.16,43.18 0 bottom
R68  53.02,43.18 0 bottom
R69  17.62,43.18 0 bottom
R70  30.32,43.18 0 bottom
R71  43.02,43.18 0 bottom
R72  55.88,43.18 0 bottom
R73  14.92,22.23 0 bottom
R74  27.62,22.23 0 bottom
R75  40.32,22.23 0 bottom
R76  52.7,22.23 0 bottom
R77  10.79,27.62 90 bottom
R78  23.81,22.23 180 bottom
R79  36.51,22.23 180 bottom
R80  49.21,22.23 180 bottom
R81  8.57,27.62 90 bottom
R82  22.54,30.16 90 bottom
R83  35.56,30.16 90 bottom
R84  48.26,28.57 90 bottom
R85  10.48,38.1 270 bottom
R86  23.97,43.18 180 bottom
R87  36.67,43.18 180 bottom
R88  49.37,43.18 180 bottom
R89  7.94,38.1 270 bottom
R90  21.11,43.18 180 bottom
R91  33.81,43.18 180 bottom
R92  46.51,43.18 180 bottom
R93  18.73,22.23 180 bottom
R94  31.43,22.23 180 bottom
R95  44.13,22.23 180 bottom
R96  56.83,26.67 180 bottom
R97  39.37,18.1 90 bottom
R98  23.5,18.73 90 bottom
R99  20.95,18.73 90 bottom
X1  38.1,0.32 0 bottom
X1_1  38.1,3.17 180 top
X2  22.23,0.32 0 bottom
X2_2  22.23,3.17 180 top

### Tracks (layer width: path | path; a pad name or v marks a point on that pad's centre or on a via)
+5V  (via drill 0.6 pad 2, 0.6 pad 2.5)
  Top 0.5: v43.18,8.26 v43.18,20
  Bottom 0.5: 41.91,82.23 42.86,83.19 IC2.10 44.45,83.19 45.29,84.02 C2.PAD_1 | 28.89,81.92 30.16,83.19 IC3.10 31.75,83.19 32.59,84.02 C3.PAD_1 | 42.23,73.5 42.23,67.94 | 29.53,73.03 29.53,67.94 | 54.93,73.82 54.93,67.94 | C6.PAD_1 19.89,84.02 19.05,83.19 IC4.10 16.83,83.19 15.56,81.92 | IC4.16 18.1,75.56 18.1,74.3 | 16.83,75.56 16.51,75.88 | 16.83,67.94 16.83,73.34 | 9.21,62.55 9.21,67.94 | 16.51,35.24 17.46,36.2 IC12.10 19.05,36.2 20.2,37.35 C9.PAD_1 | 41.91,35.24 42.86,36.2 IC10.10 44.45,36.2 45.6,37.35 C11.PAD_1 | C10.PAD_1 32.91,37.35 31.75,36.2 IC11.10 30.16,36.2 29.21,35.24 | C4.PAD_1 18.85,51.87 19.68,52.7 IC6.10 21.27,52.7 22.54,53.98 | C7.PAD_1 31.55,51.87 32.38,52.7 IC7.10 33.97,52.7 35.24,53.98 | C8.PAD_1 44.25,51.87 45.09,52.7 IC8.10 46.67,52.7 47.94,53.98 | C5.PAD_1 5.71,51.44 6.99,52.7 IC5.10 8.57,52.7 9.84,53.98 | C12.PAD_1 58.1,37.15 57.15,36.2 IC9.10 55.56,36.2 54.29,34.92 | 2.22,58.1 2.22,48.9 3.49,47.62 3.49,44.77 4.45,43.81 | C1.PAD_1 58.1,84.14 57.15,83.19 IC1.10 55.56,83.19 54.61,82.23 | 30.8,74.3 30.8,75.56 | 43.5,74.61 43.5,75.56 | 56.2,74.61 56.2,75.56 | IC5.16 7.78,61.44 7.94,61.59 | IC6.16 20.48,61.44 20.64,61.59 | IC7.16 33.18,61.44 33.34,61.59 | 34.61,67.94 34.61,62.55 | 21.91,67.94 21.91,62.55 | 47.31,67.94 47.31,62.55 | IC8.16 45.88,61.44 46.04,61.59 | IC12.16 18.26,27.46 18.1,27.3 | 16.83,20.64 16.83,26.04 | 29.53,20.64 29.53,26.35 | IC11.16 30.96,27.46 30.8,27.3 | 42.23,20.64 42.23,28.57 | IC9.16 54.93,28.57 | 54.93,21.59 54.93,28.26 | IC10.16 43.66,27.78 43.5,27.62
  Bottom 0.8: 54.93,67.94 47.31,67.94 42.23,67.94 34.61,67.94 29.53,67.94 21.91,67.94 16.83,67.94 9.21,67.94
  Bottom 1: v43.18,8.26 X1.1 X1_1.1
  pour Bottom: 2.22,57.47 5.08,60.33 5.08,67.31 5.71,67.94 13.34,67.94 12.06,69.22 6.03,69.22 2.22,65.41
  pour Bottom: 3.81,44.45 5.4,42.86 5.4,28.57 4.76,27.94 4.76,26.35 6.03,25.08 6.03,22.86 6.67,22.23 11.75,22.23 13.34,20.64 6.03,20.64 4.45,22.23 4.45,25.4 3.81,26.04
  pour Bottom: 54.29,20.95 9.84,20.95 9.84,20.64 18.73,20.64 20,19.37 24.77,19.37 25.72,20.32 38.73,20.32 39.37,19.68 39.37,18.73 40.64,18.73 40.64,18.1 40.96,17.78 43.5,17.78 43.81,18.1 43.81,19.37 45.09,20.64 55.88,20.64 55.88,21.59 54.93,22.54 54.93,21.59
  pour Bottom: 14.61,80.96 14.61,74.3 15.24,73.66 16.19,73.66 16.83,73.03 18.1,74.3 18.1,75.56 16.83,75.56 16.51,75.88 16.51,82.87
  pour Bottom: 29.21,82.23 28.89,81.92 28.89,75.56 29.53,74.93 29.53,73.03 30.8,74.3 30.8,75.56 29.84,75.56 29.21,76.2
  pour Bottom: 41.91,82.23 41.59,81.92 41.59,75.56 42.23,74.93 42.23,73.03 43.5,74.3 43.5,75.56 42.55,75.56 41.91,76.2
  pour Bottom: 54.61,82.23 54.29,81.92 54.29,75.56 54.93,74.93 54.93,73.03 56.2,74.3 56.2,75.56 55.24,75.56 54.61,76.2
  pour Bottom: 9.53,53.66 9.84,53.98 9.84,60.33 9.21,60.96 9.21,62.87 7.94,61.59 7.94,60.33 8.89,60.33 9.53,59.69
  pour Bottom: 22.23,53.66 22.54,53.98 22.54,60.33 21.91,60.96 21.91,62.87 20.64,61.59 20.64,60.33 21.59,60.33 22.23,59.69
  pour Bottom: 34.92,53.66 35.24,53.98 35.24,60.33 34.61,60.96 34.61,62.87 33.34,61.59 33.34,60.33 34.29,60.33 34.92,59.69
  pour Bottom: 47.62,53.66 47.94,53.98 47.94,60.33 47.31,60.96 47.31,62.87 46.04,61.59 46.04,60.33 46.99,60.33 47.62,59.69
  pour Bottom: 16.51,35.24 16.19,34.92 16.19,28.57 16.83,27.94 16.83,26.04 18.1,27.3 18.1,28.57 17.14,28.57 16.51,29.21
  pour Bottom: 29.21,35.24 28.89,34.92 28.89,28.57 29.53,27.94 29.53,26.04 30.8,27.3 30.8,28.57 29.84,28.57 29.21,29.21
  pour Bottom: 41.91,35.24 41.59,34.92 41.59,28.26 42.23,27.62 42.23,26.35 43.5,27.62 43.5,28.57 42.55,28.57 41.91,29.21
  pour Bottom: 54.61,35.24 54.29,34.92 54.29,28.57 54.93,27.94 54.93,28.26 55.24,28.57 54.61,29.21
DIG_CLK  (via drill 0.6 pad 1.6)
  Top 0.5: v33.34,35.56 v46.04,35.56 v58.74,35.56 | v5.71,53.66 v18.1,53.66 v30.8,53.66 v43.5,53.66 v55.56,53.66 | v58.42,82.23 v46.04,82.23 v33.34,82.23 v20.64,82.23
  Top 0.6: v20.64,35.56 v33.34,35.56
  Bottom 0.5: IC12.11 20,34.92 v20.64,35.56 | IC9.11 58.1,34.92 v58.74,35.56 | IC10.11 45.4,34.92 v46.04,35.56 | IC11.11 32.7,34.92 v33.34,35.56 | IC8.11 44.45,53.98 44.13,53.66 v43.5,53.66 | IC7.11 31.11,53.98 v30.8,53.66 | IC6.11 18.41,53.98 v18.1,53.66 | IC5.11 6.03,53.98 v5.71,53.66 | X1.2 40.64,9.21 41.59,10.16 58.1,10.16 60.01,12.06 60.01,23.5 61.91,25.4 61.91,32.7 59.05,35.56 v58.74,35.56 | v58.74,35.56 59.37,36.2 59.37,47.62 55.56,51.44 v55.56,53.66 55.56,56.2 56.73,57.37 J1.PAD_1 | IC4.11 20.32,81.92 v20.64,82.23 | IC1.11 58.1,81.92 v58.42,82.23 60.33,82.23 61.59,80.96 61.59,77.79 60.64,76.83 60.64,61.59 58.84,59.79 J1.PAD_0 | IC2.11 45.72,81.92 v46.04,82.23 | IC3.11 33.02,81.92 v33.34,82.23
  Bottom 1: X1_1.2 X1.2
DIG_DATA
  Bottom 0.5: X1.4 35.56,7.62 40.01,12.06 56.83,12.06 57.78,13.02 57.78,24.45 59.05,25.72 59.05,29.21 57.15,31.11 IC9.14
  Bottom 1: X1_1.4 X1.4
DIG_LATCH  (via drill 0.6 pad 1.6)
  Top 0.5: v33.34,33.34 v46.04,33.34 v58.74,33.34 | v20.64,80.33 v33.34,80.33 v46.04,80.33 v60.01,80.33 | v5.71,55.56 v18.1,55.56 v30.8,55.56 v43.5,55.56 v57.78,55.56
  Top 0.6: v20.64,33.34 v33.34,33.34
  Bottom 0.5: IC12.12 20.32,33.66 v20.64,33.34 | IC9.12 58.42,33.66 v58.74,33.34 59.69,33.34 60.96,32.07 60.96,26.04 58.96,24.03 J2.PAD_1 59.05,21.91 59.05,12.7 57.47,11.11 40.96,11.11 38.1,8.26 X1.3 | IC10.12 45.72,33.66 v46.04,33.34 | IC11.12 33.02,33.66 v33.34,33.34 | IC3.12 33.02,80.64 v33.34,80.33 | IC1.12 59.69,80.64 v60.01,80.33 60.64,79.69 60.64,78.11 59.69,77.15 59.69,62.55 57.78,60.64 v57.78,55.56 57.78,50.8 60.33,48.26 60.33,36.83 62.87,34.29 62.87,24.77 61.06,22.96 J2.PAD_0 | v43.5,55.56 43.81,55.24 IC8.12 | v30.8,55.56 31.11,55.24 IC7.12 | v18.1,55.56 18.41,55.24 IC6.12 | v5.71,55.56 6.03,55.24 IC5.12 | IC2.12 45.72,80.64 v46.04,80.33 | IC4.12 20.32,80.64 v20.64,80.33
  Bottom 1: X1_1.3 X1.3
GND  (via drill 0.6 pad 1.6, 0.6 pad 2, 1 pad 3)
  Top 0.5: v28.26,10.16 v16.51,10.16 | v59.37,31.11 v46.99,31.11 | v58.74,78.74 v47.62,78.74
  Top 0.8: v9.21,43.5 v1.91,43.5
  Bottom 0.5: IC3.8 25.56,87.15 DS2.8 25.72,92.71 | 50.48,92.71 51.12,92.08 DS4.8 51.12,84.45 IC1.8 | 38.42,92.71 DS3.8 38.42,84.45 IC2.8 | IC3.13 31.75,79.38 32.38,78.74 33.97,78.74 34.92,79.69 34.92,84.77 34.17,85.52 C3.PAD_0 32.27,85.52 32.07,85.72 32.07,92.71 | 44.77,92.71 44.77,86.04 45.29,85.52 C2.PAD_0 46.88,85.52 47.62,84.77 v47.62,78.74 45.4,78.74 44.77,79.38 IC2.13 | 19.37,92.71 19.37,86.04 19.89,85.52 C6.PAD_0 21.48,85.52 22.23,84.77 22.23,79.69 21.27,78.74 20,78.74 19.37,79.38 IC4.13 | IC4.8 13.02,84.61 DS1.8 13.02,89.53 12.06,90.49 | IC5.8 13.18,48.74 DS5.3 13.02,44.45 DS9.8 12.86,40.16 IC12.8 | IC11.8 25.56,40.16 DS10.8 25.72,44.45 DS6.3 25.72,51.28 IC6.8 | IC10.8 38.42,37.62 DS11.8 38.42,44.45 DS7.3 38.42,51.28 IC7.8 | IC9.8 51.12,37.62 DS12.8 51.12,44.45 DS8.3 51.12,51.44 IC8.8 | IC6.13 19.37,56.52 18.73,57.15 17.14,57.15 16.51,56.52 16.51,53.02 17.14,52.39 17.14,50.8 17.58,50.37 C4.PAD_0 18.85,50.37 19.37,49.85 19.37,44.45 19.37,39.37 19.89,38.85 C9.PAD_0 21.16,38.85 22.23,37.78 22.23,32.38 21.27,31.43 20,31.43 19.05,32.38 IC12.13 | IC7.13 32.38,56.52 31.75,57.15 29.84,57.15 29.21,56.52 29.21,51.12 29.96,50.37 C7.PAD_0 31.55,50.37 32.07,49.85 32.07,44.45 32.07,39.05 32.27,38.85 C10.PAD_0 33.86,38.85 34.92,37.78 34.92,32.38 34.29,31.75 32.7,31.75 32.07,32.38 IC11.13 | IC8.13 44.77,56.52 44.13,57.15 42.86,57.15 41.91,56.2 41.91,50.8 42.34,50.37 C8.PAD_0 44.25,50.37 44.77,49.85 44.77,44.45 44.77,39.05 44.97,38.85 C11.PAD_0 46.56,38.85 47.62,37.78 47.62,31.75 v46.99,31.11 46.04,31.11 44.77,32.38 IC10.13 | 6.35,44.77 5.71,45.4 C5.PAD_0 4.88,49.1 4.13,49.85 4.13,56.52 4.76,57.15 6.35,57.15 6.99,56.52 IC5.13
  Bottom 0.5: IC1.13 57.47,79.38 58.1,78.74 v58.74,78.74 | IC9.13 57.47,32.38 58.74,31.11 v59.37,31.11 | C12.PAD_0 58.1,43.81 57.47,44.45 | v16.51,10.16 16.51,13.97 | C1.PAD_0 60.12,88.15 59.05,89.22 58.1,89.22 57.15,90.17 55.88,90.17 54.29,91.76 | C13.MINUS 0.64,24.13 | 0.64,24.13 0.64,22.86 | 0.64,24.13 0.64,25.4
  Bottom 0.6: 5.71,88.27 7.94,90.49
  Bottom 0.8: 13.02,44.45 19.37,44.45 25.72,44.45 32.07,44.45 38.42,44.45 44.77,44.45 51.12,44.45 57.47,44.45
  Bottom 1: 33.02,11.11 X1.5 X1_1.5 | KEY3.4 KEY3.3 47.59,13.97 42.3,13.97 D1.ANODE 35.3,13.89 KEY2.4 | 28.26,13.97 28.29,13.94 | 28.26,13.97 28.26,12.06 | 35.28,13.97 28.26,13.97
  pour Bottom: 0.64,10.16 7.62,10.16 10.16,7.62 10.16,1.27 16.51,1.27 16.51,7.94 16.83,8.26 16.83,16.19 6.67,16.19 5.71,17.14 5.71,19.05 1.91,22.86 1.91,25.4 2.54,26.04 2.54,46.99 1.27,48.26 1.27,66.04 6.35,71.12 6.35,75.56 9.84,79.06 6.35,82.55 6.35,88.9 0.64,88.9
  pour Bottom: 26.99,7.62 32.38,7.62 33.02,6.99 40.32,13.97 27.62,13.97 27.62,12.7 26.04,11.11 26.04,8.57
  pour Bottom: 6.35,44.77 7.94,43.18 8.57,43.18 11.11,43.18 12.38,43.18 13.02,42.55 13.02,44.77 12.7,44.45 6.99,44.45 6.67,44.77
  pour Bottom: 7.62,90.17 12.38,90.17 12.7,89.85 12.7,92.39 13.34,93.03 17.78,93.03 19.37,91.44 20.95,93.03 25.08,93.03 25.72,92.39 26.35,93.03 30.8,93.03 32.07,91.76 33.34,93.03 37.78,93.03 38.42,92.39 39.05,93.03 43.5,93.03 44.77,91.76 46.04,93.03 50.8,93.03 51.12,92.71 51.12,91.44 54.61,91.44 53.34,92.71 53.34,99.06 10.48,99.06 10.48,93.03
KEY1_LINE
  Bottom 0.5: 18.21,17.98 R99.PAD_0 20.95,16.83 20.32,16.19 20.32,15.24
  Bottom 1: 20.32,15.24 20.32,7.62 19.68,6.99 X2.3 X2_2.3 | 18.21,17.98 16.98,17.98 KEY1.1 KEY1.2
KEY2_LINE
  Bottom 0.5: 22.23,15.24 22.23,16.19 23.5,17.46 R98.PAD_0 24.65,17.98 25.08,18.41 28.22,18.41 KEY2.2
  Bottom 1: 22.23,15.24 X2.2 X2_2.2 | KEY2.2 KEY2.1
KEY3_LINE
  Bottom 0.6: R97.PAD_0 39.37,16.19
  Bottom 1: X2_2.1 X2.1 24.77,6.99 24.13,7.62 24.13,14.92 25.4,16.19 39.37,16.19 39.69,15.88 44.13,15.88 46.7,18.44 KEY3.2 KEY3.1
N$1
  Bottom 0.5: R4.PAD_0 53.77,87.43 DS4.7
N$2
  Bottom 0.5: R8.PAD_0 56.63,87.75 DS4.6
N$3
  Bottom 0.5: R12.PAD_0 53.77,71.96 DS4.4
N$4
  Bottom 0.5: R16.PAD_0 48.46,71.96 DS4.2
N$5
  Bottom 0.5: R20.PAD_0 47.62,74.93 47.94,74.61 47.94,73.34 46.67,72.07 DS4.1
N$6
  Bottom 0.5: DS4.9 48.58,91.12 49.01,91.56 R24.PAD_0
N$7
  Bottom 0.5: DS4.10 46.04,91.12 46.47,91.56 R28.PAD_0
N$8
  Bottom 0.5: DS4.5 56.08,71.96 R32.PAD_0
N$9
  Bottom 0.5: R36.PAD_0 53.77,63.93 DS8.7
N$10
  Bottom 0.5: R40.PAD_0 54.29,62.55 55.56,63.82 DS8.6
N$11
  Bottom 0.5: R44.PAD_0 53.61,48.53 DS8.4
N$12
  Bottom 0.5: R48.PAD_0 48.58,45.76 DS8.2
N$13
  Bottom 0.5: R52.PAD_0 45.76,48.3 DS8.1
N$14
  Bottom 0.5: R56.PAD_0 48.46,63.93 DS8.9
N$15
  Bottom 0.5: R60.PAD_0 46.15,63.93 DS8.10
N$16
  Bottom 0.5: R64.PAD_0 56.47,48.3 DS8.5
N$17
  Bottom 0.5: DS3.7 40.96,91.12 40.52,91.56 R3.PAD_0
N$18
  Bottom 0.5: R7.PAD_0 43.06,91.56 43.5,91.12 DS3.6
N$19
  Bottom 0.5: R11.PAD_0 41.07,71.96 DS3.4
N$20
  Bottom 0.5: R15.PAD_0 35.76,71.96 DS3.2
N$21  (via drill 0.6 pad 1.6)
  Top 0.5: v27.94,74.03 v21.05,74.03
  Bottom 0.5: IC3.9 30.16,84.45 27.94,82.23 v27.94,74.03 | v21.05,74.03 21.05,76.42 19.37,78.11 IC4.14
N$22
  Bottom 0.5: DS3.1 33.97,72.07 35.24,73.34 R19.PAD_0
N$23
  Bottom 0.5: DS3.9 35.88,91.12 36.31,91.56 R23.PAD_0
N$24
  Bottom 0.5: DS3.10 33.34,91.12 33.77,91.56 R27.PAD_0
N$25
  Bottom 0.5: R31.PAD_0 43.38,71.96 DS3.5
N$26  (via drill 0.6 pad 1.6)
  Top 0.5: v40.64,73.98 v33.66,73.98
  Bottom 0.5: IC2.9 42.86,84.45 40.64,82.23 v40.64,73.98 | IC3.14 31.75,78.11 33.66,76.2 v33.66,73.98
N$27  (via drill 0.6 pad 1.6)
  Top 0.5: v46.35,73.98 v53.34,73.98
  Bottom 0.5: IC1.9 55.56,84.45 53.34,82.23 v53.34,73.98 | IC2.14 44.77,78.11 46.35,76.52 v46.35,73.98
N$28
  Bottom 0.5: R35.PAD_0 40.76,64.02 DS7.7
N$29
  Bottom 0.5: R39.PAD_0 41.59,62.55 42.86,63.82 DS7.6
N$30
  Bottom 0.5: R43.PAD_0 40.96,45.76 DS7.4
N$31
  Bottom 0.5: R47.PAD_0 35.88,45.76 DS7.2
N$32
  Bottom 0.5: R51.PAD_0 33.06,48.3 DS7.1
N$33
  Bottom 0.5: R55.PAD_0 35.76,63.93 DS7.9
N$34
  Bottom 0.5: R59.PAD_0 33.45,63.93 DS7.10
N$35
  Bottom 0.5: R63.PAD_0 43.77,48.3 DS7.5
N$36
  Bottom 0.5: DS2.7 28.26,91.12 27.82,91.56 R2.PAD_0
N$37
  Bottom 0.5: DS2.6 30.8,91.12 30.36,91.56 R6.PAD_0
N$38
  Bottom 0.5: R10.PAD_0 28.37,71.96 DS2.4
N$39
  Bottom 0.5: R14.PAD_0 23.06,71.96 DS2.2
N$40
  Bottom 0.5: DS2.1 21.27,72.07 22.54,73.34 R18.PAD_0
N$41
  Bottom 0.5: DS2.9 23.18,91.12 23.61,91.56 R22.PAD_0
N$42
  Bottom 0.5: DS2.10 20.64,91.12 21.07,91.56 R26.PAD_0
N$43
  Bottom 0.5: R30.PAD_0 30.68,71.96 DS2.5
N$44
  Bottom 0.5: R34.PAD_0 28.37,63.93 DS6.7
N$45
  Bottom 0.5: R38.PAD_0 28.89,62.55 30.16,63.82 DS6.6
N$46
  Bottom 0.5: R42.PAD_0 28.21,48.53 DS6.4
N$47
  Bottom 0.5: R46.PAD_0 23.22,48.53 DS6.2
N$48
  Bottom 0.5: R50.PAD_0 20.36,48.3 DS6.1
N$49
  Bottom 0.5: R54.PAD_0 23.06,63.93 DS6.9
N$50
  Bottom 0.5: R58.PAD_0 20.75,63.93 DS6.10
N$51
  Bottom 0.5: R62.PAD_0 31.07,48.3 DS6.5
N$52
  Bottom 0.5: R33.PAD_0 15.36,64.02 DS5.7
N$53
  Bottom 0.5: DS1.7 15.56,91.12 15.12,91.56 R1.PAD_0
N$54
  Bottom 0.5: R5.PAD_0 17.66,91.56 18.1,91.12 DS1.6
N$55
  Bottom 0.5: R9.PAD_0 15.67,71.96 DS1.4
N$56
  Bottom 0.5: DS1.2 R13.PAD_0
N$57
  Bottom 0.5: DS1.1 8.26,72.39 R17.PAD_0
N$58
  Bottom 0.5: R21.PAD_0 DS1.9
N$59
  Bottom 0.5: R25.PAD_0 DS1.10
N$60
  Bottom 0.5: DS1.5 18.1,70.48 17.98,70.37 R29.PAD_0
N$61
  Bottom 0.5: R37.PAD_0 16.19,62.55 17.46,63.82 DS5.6
N$62
  Bottom 0.5: R41.PAD_0 15.51,48.53 DS5.4
N$63
  Bottom 0.5: DS5.2 10.48,46.99 10.36,46.88 R45.PAD_0
N$64
  Bottom 0.5: DS5.1 7.94,46.99 7.5,46.56 R49.PAD_0
N$65
  Bottom 0.5: DS5.9 10.36,63.93 R53.PAD_0
N$66
  Bottom 0.5: R57.PAD_0 8.05,63.93 DS5.10
N$67
  Bottom 0.5: R61.PAD_0 18.37,48.3 DS5.5
N$68  (via drill 0.6 pad 1.6)
  Top 0.5: v36.2,61.91 v43.18,61.91
  Bottom 0.5: IC7.9 33.97,51.44 36.2,53.66 v36.2,61.91 | v43.18,61.91 43.18,59.37 44.77,57.78 IC8.14
N$69  (via drill 0.6 pad 1.6)
  Top 0.5: v23.5,61.91 v30.48,61.91
  Bottom 0.5: IC6.9 21.27,51.44 23.5,53.66 v23.5,61.91 | v30.48,61.91 30.48,59.69 32.38,57.78 IC7.14
N$70  (via drill 0.6 pad 1.6)
  Top 0.5: v10.79,61.91 v17.78,61.91
  Bottom 0.5: IC5.9 8.57,51.44 10.79,53.66 v10.79,61.91 | v17.78,61.91 17.78,59.37 19.37,57.78 IC6.14
N$71
  Bottom 0.5: DS12.7 53.77,40.44 R68.PAD_0
N$72
  Bottom 0.5: R72.PAD_0 56.63,42.02 56.2,41.59 DS12.6
N$73
  Bottom 0.5: R76.PAD_0 53.45,24.88 DS12.4
N$74
  Bottom 0.5: R80.PAD_0 48.46,24.97 DS12.2
N$75
  Bottom 0.5: DS12.1 46.67,25.08 48.26,26.67 R84.PAD_0
N$76
  Bottom 0.5: DS12.9 48.62,40.37 R88.PAD_0
N$77
  Bottom 0.5: R92.PAD_0 45.76,40.6 DS12.10
N$78
  Bottom 0.5: R96.PAD_0 56.08,25.2 DS12.5
N$79
  Bottom 0.5: DS11.7 40.96,43.14 R67.PAD_0
N$80
  Bottom 0.5: DS11.6 43.5,42.23 43.81,42.55 43.81,43.14 R71.PAD_0
N$81
  Bottom 0.5: R75.PAD_0 41.07,24.97 DS11.4
N$82
  Bottom 0.5: R79.PAD_0 35.76,24.97 DS11.2
N$83
  Bottom 0.5: R83.PAD_0 35.56,26.67 33.97,25.08 DS11.1
N$84
  Bottom 0.5: DS11.9 35.92,40.37 R87.PAD_0
N$85
  Bottom 0.5: DS11.10 33.06,40.6 R91.PAD_0
N$86
  Bottom 0.5: R95.PAD_0 43.38,24.97 DS11.5
N$87
  Bottom 0.5: DS10.7 28.21,40.37 R66.PAD_0
N$88
  Bottom 0.5: DS10.6 31.07,40.6 R70.PAD_0
N$89
  Bottom 0.5: R74.PAD_0 28.37,24.97 DS10.4
N$90
  Bottom 0.5: R78.PAD_0 23.06,24.97 DS10.2
N$91
  Bottom 0.5: DS10.1 21.27,25.08 22.54,26.35 R82.PAD_0
N$92
  Bottom 0.5: DS10.9 23.18,43.14 R86.PAD_0
N$93
  Bottom 0.5: DS10.10 20.36,40.6 R90.PAD_0
N$94
  Bottom 0.5: R94.PAD_0 30.68,24.97 DS10.5
N$95
  Bottom 0.5: DS9.7 15.56,43.14 R65.PAD_0
N$96
  Bottom 0.5: DS9.6 18.1,42.23 18.41,42.55 18.41,43.14 R69.PAD_0
N$97
  Bottom 0.5: R73.PAD_0 15.67,24.97 DS9.4
N$98
  Bottom 0.5: DS9.2 10.48,26.04 10.79,26.35 R77.PAD_0
N$99
  Bottom 0.5: DS9.1 7.94,25.72 8.57,26.35 R81.PAD_0
N$100
  Bottom 0.5: DS9.9 R85.PAD_0
N$101
  Bottom 0.5: DS9.10 R89.PAD_0
N$102
  Bottom 0.5: R93.PAD_0 17.98,24.97 DS9.5
N$103  (via drill 0.6 pad 1.6)
  Top 0.5: v27.94,26.99 v20.95,26.99
  Bottom 0.5: IC11.9 30.16,37.47 27.94,35.24 v27.94,26.99 | v20.95,26.99 20.95,29.21 19.05,31.11 IC12.14
N$104  (via drill 0.6 pad 1.6)
  Top 0.5: v40.64,26.99 v33.66,26.99
  Bottom 0.5: IC10.9 42.86,37.47 40.64,35.24 v40.64,26.99 | v33.66,26.99 33.66,29.53 32.07,31.11 IC11.14
N$105  (via drill 0.6 pad 1.6)
  Top 0.5: v53.34,26.99 v46.35,26.99
  Bottom 0.5: IC9.9 55.56,37.47 53.34,35.24 v53.34,26.99 | v46.35,26.99 46.35,29.21 44.45,31.11 IC10.14
N$106  (via drill 0.6 pad 1.6)
  Top 0.5: v56.2,61.91 v48.9,61.91
  Bottom 0.5: IC1.14 57.15,78.11 58.74,76.52 58.74,63.82 56.83,61.91 v56.2,61.91 | v48.9,61.91 48.9,53.66 46.67,51.44 IC8.9
N$107  (via drill 0.6 pad 1.6)
  Top 0.5: v15.24,26.99 v6.35,26.99
  Bottom 0.5: IC12.9 17.46,37.47 15.24,35.24 v15.24,26.99 | v6.35,26.99 6.35,43.18 4.76,44.77 4.76,47.62 3.17,49.21 3.17,56.83 4.45,58.1 6.67,58.1 6.99,57.78 IC5.14
N$108  (via drill 3 pad 6)
  other vias: 5,95
N$109  (via drill 3 pad 6)
  other vias: 59,95
N$110  (via drill 3 pad 6)
  other vias: 59,5
N$111  (via drill 3 pad 6)
  other vias: 5,5
SR1_D0
  Bottom 0.5: IC4.15 19.37,76.83 19.68,76.52 19.68,74.93 19.37,74.61 19.37,70.17 19.48,70.05 R29.PAD_1
SR1_D1
  Bottom 0.5: R9.PAD_1 14.17,70.05 14.29,70.17 14.29,72.71 13.02,73.98 13.02,75.41 IC4.1
SR1_D2
  Bottom 0.5: IC4.2 11.43,76.83 10.48,75.88 R13.PAD_1
SR1_D3
  Bottom 0.5: IC4.3 10.79,78.11 8.26,75.56 R17.PAD_1
SR1_D4
  Bottom 0.5: IC4.4 11.43,79.38 7.94,82.87 R25.PAD_1
SR1_D5
  Bottom 0.5: IC4.5 11.75,80.64 10.48,81.92 R21.PAD_1
SR1_D6
  Bottom 0.5: R5.PAD_1 16.83,84.77 13.97,81.92 IC4.6
SR1_D7
  Bottom 0.5: R1.PAD_1 14.29,83.5 13.97,83.19 IC4.7
SR2_D0
  Bottom 0.5: IC3.15 31.75,76.83 32.38,76.2 32.38,74.61 32.07,74.3 32.07,70.17 32.18,70.05 R30.PAD_1
SR2_D1
  Bottom 0.5: IC3.1 25.56,74.14 26.99,72.71 26.99,70.17 26.87,70.05 R10.PAD_1
SR2_D2
  Bottom 0.5: IC3.2 24.45,76.83 23.81,76.2 23.81,73.98 24.45,73.34 24.45,70.17 24.56,70.05 R14.PAD_1
SR2_D3
  Bottom 0.5: R18.PAD_1 23.93,77.9 24.13,78.11 IC3.3
SR2_D4
  Bottom 0.5: R26.PAD_1 21.91,86.68 23.18,85.41 23.18,80.64 24.45,79.38 IC3.4
SR2_D5
  Bottom 0.5: R22.PAD_1 24.45,85.72 24.13,85.41 24.13,80.96 24.45,80.64 IC3.5
SR2_D6
  Bottom 0.5: R6.PAD_1 29.53,85.09 26.35,81.92 IC3.6
SR2_D7
  Bottom 0.5: IC3.7 26.35,83.19 26.99,83.82 R2.PAD_1
SR3_D0
  Bottom 0.5: IC2.15 44.77,76.83 45.09,76.52 45.09,74.93 44.77,74.61 44.77,70.37 44.88,70.25 R31.PAD_1
SR3_D1
  Bottom 0.5: R11.PAD_1 39.57,70.05 39.69,70.17 39.69,72.71 38.1,74.3 38.1,75.41 IC2.1
SR3_D2
  Bottom 0.5: IC2.2 37.15,76.83 36.51,76.2 36.51,73.66 37.15,73.03 37.15,70.17 37.26,70.05 R15.PAD_1
SR3_D3
  Bottom 0.5: R19.PAD_1 36.31,77.9 36.51,78.11 IC2.3
SR3_D4
  Bottom 0.5: IC2.4 37.15,79.38 35.88,80.64 35.88,85.41 34.61,86.68 R27.PAD_1
SR3_D5
  Bottom 0.5: IC2.5 37.15,80.64 36.83,80.96 36.83,85.41 37.15,85.72 R23.PAD_1
SR3_D6
  Bottom 0.5: IC2.6 39.05,81.92 42.23,85.09 R7.PAD_1
SR3_D7
  Bottom 0.5: R3.PAD_1 39.69,83.82 39.05,83.19 IC2.7
SR4_D0
  Bottom 0.5: R32.PAD_1 57.58,70.6 57.78,70.8 57.78,76.2 57.15,76.83 IC1.15
SR4_D1
  Bottom 0.5: IC1.1 51.44,75.56 51.44,73.66 52.39,72.71 52.39,70.17 52.27,70.05 R12.PAD_1
SR4_D2
  Bottom 0.5: IC1.2 49.85,76.83 49.53,76.52 49.53,73.98 49.85,73.66 49.85,70.17 49.96,70.05 R16.PAD_1
SR4_D3
  Bottom 0.5: IC1.3 49.53,78.11 48.38,76.95 R20.PAD_1
SR4_D4
  Bottom 0.5: R28.PAD_1 47.3,90.05 47.3,86.69 48.58,85.41 48.58,80.33 49.53,79.38 IC1.4
SR4_D5
  Bottom 0.5: R24.PAD_1 49.9,90 49.9,86.09 49.53,85.72 49.53,80.96 49.85,80.64 IC1.5
SR4_D6
  Bottom 0.5: IC1.6 51.75,81.92 55.56,85.72 57.15,85.72 57.67,86.25 R8.PAD_1
SR4_D7
  Bottom 0.5: IC1.7 51.75,83.19 52.39,83.82 52.39,89.22 52.27,89.33 R4.PAD_1
SR5_D0
  Bottom 0.5: IC5.15 6.99,59.05 6.35,59.69 6.35,65.41 6.55,65.61 R57.PAD_1
SR5_D1
  Bottom 0.5: IC5.1 13.18,61.75 11.75,63.18 11.75,65.72 11.86,65.84 R53.PAD_1
SR5_D2
  Bottom 0.5: IC5.2 14.29,59.05 14.92,59.69 14.92,62.23 14.29,62.87 14.29,65.72 13.86,66.16 R33.PAD_1
SR5_D3
  Bottom 0.5: IC5.3 14.61,57.78 15.44,58.62 R37.PAD_1
SR5_D4
  Bottom 0.5: IC5.4 14.61,56.52 15.56,55.56 15.56,52.7 16.19,52.07 16.19,50.16 16.83,49.53 16.83,46.67 16.87,46.63 R61.PAD_1
SR5_D5
  Bottom 0.5: IC5.5 14.29,55.24 14.61,54.93 14.61,52.39 14.92,52.07 14.92,50.48 14.29,49.85 14.29,46.67 14.01,46.4 R41.PAD_1
SR5_D6
  Bottom 0.5: R49.PAD_1 9.01,46.47 9.21,46.67 9.21,50.8 12.38,53.98 IC5.6
SR5_D7
  Bottom 0.5: IC5.7 12.38,52.7 11.75,52.07 11.75,46.67 11.86,46.56 R45.PAD_1
SR6_D0
  Bottom 0.5: IC6.15 19.37,59.05 18.73,59.69 18.73,60.64 19.37,61.28 19.37,65.72 19.25,65.84 R58.PAD_1
SR6_D1
  Bottom 0.5: IC6.1 25.88,61.75 24.45,63.18 24.45,65.72 24.56,65.84 R54.PAD_1
SR6_D2
  Bottom 0.5: IC6.2 26.99,59.05 27.3,59.37 27.3,62.23 26.99,62.55 26.99,65.72 26.87,65.84 R34.PAD_1
SR6_D3
  Bottom 0.5: IC6.3 27.3,57.78 28.14,58.62 R38.PAD_1
SR6_D4
  Bottom 0.5: IC6.4 27.3,56.52 28.26,55.56 28.26,50.48 29.53,49.21 29.53,45.76 R62.PAD_1
SR6_D5
  Bottom 0.5: IC6.5 26.99,55.24 27.3,54.93 27.3,49.85 26.99,49.53 26.99,46.67 26.71,46.4 R42.PAD_1
SR6_D6
  Bottom 0.5: IC6.6 25.08,53.98 21.91,50.8 21.91,46.67 21.86,46.63 R50.PAD_1
SR6_D7
  Bottom 0.5: IC6.7 25.08,52.7 24.45,52.07 24.45,46.67 24.72,46.4 R46.PAD_1
SR7_D0
  Bottom 0.5: IC7.15 32.38,59.05 31.43,60.01 31.43,60.64 32.07,61.28 32.07,65.72 31.95,65.84 R59.PAD_1
SR7_D1
  Bottom 0.5: R55.PAD_1 37.26,65.84 37.15,65.72 37.15,63.18 38.1,62.23 38.1,60.33 IC7.1
SR7_D2
  Bottom 0.5: IC7.2 39.69,59.05 40.01,59.37 40.01,61.28 39.69,61.59 39.69,65.72 39.26,66.16 R35.PAD_1
SR7_D3
  Bottom 0.5: IC7.3 40.01,57.78 40.84,58.62 R39.PAD_1
SR7_D4
  Bottom 0.5: IC7.4 40.01,56.52 40.96,55.56 40.96,50.48 42.23,49.21 42.23,45.76 R63.PAD_1
SR7_D5
  Bottom 0.5: IC7.5 39.69,55.24 40.01,54.93 40.01,50.48 39.69,50.16 39.69,46.67 39.41,46.4 R43.PAD_1
SR7_D6
  Bottom 0.5: IC7.6 37.78,53.98 34.61,50.8 34.61,45.76 R51.PAD_1
SR7_D7
  Bottom 0.5: IC7.7 37.78,52.7 36.83,51.75 36.83,50.48 37.15,50.16 37.15,46.67 37.42,46.4 R47.PAD_1
SR8_D0
  Bottom 0.5: IC8.15 44.77,59.05 44.13,59.69 44.13,60.64 44.77,61.28 44.77,65.72 44.65,65.84 R60.PAD_1
SR8_D1
  Bottom 0.5: R56.PAD_1 49.96,65.84 49.85,65.72 49.85,63.18 51.28,61.75 IC8.1
SR8_D2
  Bottom 0.5: R36.PAD_1 52.27,65.84 52.39,65.72 52.39,62.55 52.7,62.23 52.7,59.37 52.39,59.05 IC8.2
SR8_D3
  Bottom 0.5: R40.PAD_1 53.23,58.3 52.7,57.78 IC8.3
SR8_D4
  Bottom 0.5: IC8.4 52.7,56.52 53.66,55.56 53.66,50.48 54.93,49.21 54.93,45.76 R64.PAD_1
SR8_D5
  Bottom 0.5: IC8.5 52.39,55.24 52.7,54.93 52.7,49.85 52.39,49.53 52.39,46.67 52.11,46.4 R44.PAD_1
SR8_D6
  Bottom 0.5: IC8.6 50.48,53.98 47.31,50.8 47.31,45.76 R52.PAD_1
SR8_D7
  Bottom 0.5: IC8.7 50.48,52.7 49.85,52.07 49.85,46.67 50.12,46.4 R48.PAD_1
SR9_D0
  Bottom 0.5: IC12.15 19.05,29.84 19.68,29.21 19.68,27.62 19.37,27.3 19.37,23.18 19.48,23.06 R93.PAD_1
SR9_D1
  Bottom 0.5: R73.PAD_1 14.17,23.06 14.29,23.18 14.29,25.72 13.02,26.99 13.02,28.42 IC12.1
SR9_D2
  Bottom 0.5: IC12.2 11.43,29.84 10.79,29.21 R77.PAD_1
SR9_D3
  Bottom 0.5: IC12.3 10.48,31.11 8.57,29.21 R81.PAD_1
SR9_D4
  Bottom 0.5: IC12.4 11.75,32.38 7.94,36.2 R89.PAD_1
SR9_D5
  Bottom 0.5: IC12.5 11.75,33.66 10.48,34.92 R85.PAD_1
SR9_D6
  Bottom 0.5: IC12.6 13.65,34.92 15.24,36.51 15.24,38.1 16.83,39.69 16.83,43.14 R69.PAD_1
SR9_D7
  Bottom 0.5: IC12.7 13.65,36.2 14.29,36.83 14.29,42.23 14.01,42.5 R65.PAD_1
SR10_D0
  Bottom 0.5: IC11.15 31.75,29.84 32.38,29.21 32.38,27.62 32.07,27.3 32.07,23.18 32.18,23.06 R94.PAD_1
SR10_D1
  Bottom 0.5: R74.PAD_1 26.87,23.06 26.99,23.18 26.99,25.72 25.72,26.99 25.72,28.42 IC11.1
SR10_D2
  Bottom 0.5: IC11.2 24.45,29.84 24.13,29.53 24.13,26.35 24.45,26.04 24.45,23.18 24.56,23.06 R78.PAD_1
SR10_D3
  Bottom 0.5: R82.PAD_1 23.61,30.91 23.81,31.11 IC11.3
SR10_D4
  Bottom 0.5: IC11.4 24.45,32.38 23.18,33.66 23.18,38.42 21.91,39.69 21.91,43.14 R90.PAD_1
SR10_D5
  Bottom 0.5: IC11.5 24.45,33.66 24.13,33.97 24.13,38.1 24.45,38.42 24.45,42.23 24.72,42.5 R86.PAD_1
SR10_D6
  Bottom 0.5: IC11.6 26.35,34.92 27.94,36.51 27.94,38.1 29.53,39.69 29.53,42.23 29.57,42.27 R70.PAD_1
SR10_D7
  Bottom 0.5: IC11.7 26.35,36.2 26.99,36.83 26.99,42.23 26.71,42.5 R66.PAD_1
SR11_D0
  Bottom 0.5: R95.PAD_1 44.88,23.06 44.77,23.18 44.77,27.62 45.09,27.94 45.09,29.21 44.45,29.84 IC10.15
SR11_D1
  Bottom 0.5: R75.PAD_1 39.57,23.06 39.69,23.18 39.69,25.72 38.26,27.15 IC10.1
SR11_D2
  Bottom 0.5: IC10.2 37.47,29.84 36.83,29.21 36.83,26.67 37.15,26.35 37.15,23.18 37.26,23.06 R79.PAD_1
SR11_D3
  Bottom 0.5: IC10.3 36.83,31.11 36.63,30.91 R83.PAD_1
SR11_D4
  Bottom 0.5: IC10.4 36.83,32.38 35.88,33.34 35.88,38.42 34.61,39.69 34.61,42.23 34.56,42.27 R91.PAD_1
SR11_D5
  Bottom 0.5: IC10.5 37.15,33.66 36.83,33.97 36.83,39.05 37.15,39.37 37.15,42.23 37.42,42.5 R87.PAD_1
SR11_D6
  Bottom 0.5: IC10.6 39.05,34.92 40.64,36.51 40.64,38.1 42.23,39.69 42.23,43.14 R71.PAD_1
SR11_D7
  Bottom 0.5: IC10.7 39.05,36.2 39.69,36.83 39.69,42.23 39.41,42.5 R67.PAD_1
SR12_D0
  Bottom 0.5: R96.PAD_1 57.58,27.42 57.78,27.62 57.78,29.21 57.15,29.84 IC9.15
SR12_D1
  Bottom 0.5: R76.PAD_1 51.95,22.75 52.39,23.18 52.39,25.72 50.96,27.15 IC9.1
SR12_D2
  Bottom 0.5: IC9.2 49.85,29.84 49.53,29.53 49.53,26.04 49.85,25.72 49.85,23.18 49.96,23.06 R80.PAD_1
SR12_D3
  Bottom 0.5: IC9.3 49.21,31.11 48.26,30.16 R84.PAD_1
SR12_D4
  Bottom 0.5: IC9.4 49.85,32.38 48.58,33.66 48.58,38.42 47.31,39.69 47.31,43.14 R92.PAD_1
SR12_D5
  Bottom 0.5: IC9.5 49.85,33.66 49.53,33.97 49.53,38.1 49.85,38.42 49.85,42.23 50.12,42.5 R88.PAD_1
SR12_D6
  Bottom 0.5: IC9.6 51.75,34.92 53.34,36.51 53.34,38.1 54.93,39.69 54.93,42.23 55.13,42.43 R72.PAD_1
SR12_D7
  Bottom 0.5: IC9.7 51.75,36.2 52.39,36.83 52.39,42.23 52.27,42.34 R68.PAD_1